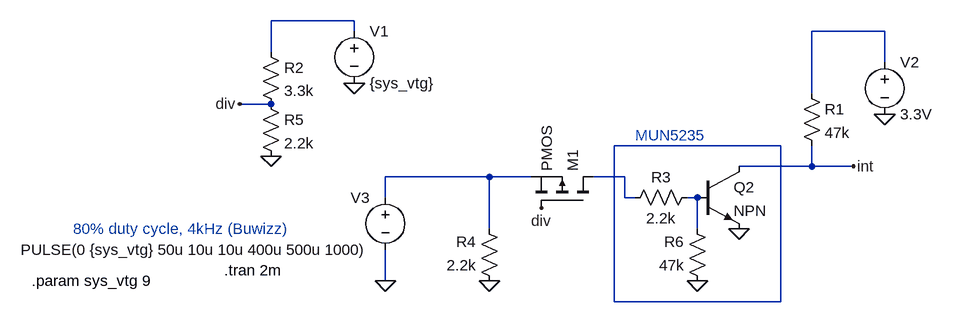
[diagram p0: schematic atomlink_PF_reader_v4.asc]
atomlink_PF_reader_v4.asc, the LTspice schematic file:
Version 4
SHEET 1 880 680
WIRE -960 -528 -1088 -528
WIRE -960 -512 -960 -528
WIRE -144 -512 -256 -512
WIRE -1088 -480 -1088 -528
WIRE -144 -464 -144 -512
WIRE -256 -416 -256 -512
WIRE -1088 -400 -1136 -400
WIRE -304 -336 -560 -336
WIRE -256 -304 -256 -336
WIRE -256 -304 -368 -304
WIRE -192 -304 -256 -304
WIRE -752 -288 -912 -288
WIRE -688 -288 -752 -288
WIRE -544 -288 -592 -288
WIRE -912 -256 -912 -288
WIRE -544 -256 -544 -288
WIRE -528 -256 -544 -256
WIRE -432 -256 -448 -256
WIRE -752 -208 -752 -288
WIRE -432 -208 -432 -256
WIRE -912 -128 -912 -176
WIRE -560 -96 -560 -336
WIRE -304 -96 -304 -336
WIRE -304 -96 -560 -96
FLAG -752 -128 0
FLAG -1088 -320 0
FLAG -192 -304 int
FLAG -144 -384 0
FLAG -672 -240 div
FLAG -960 -432 0
FLAG -1136 -400 div
FLAG -368 -208 0
FLAG -432 -128 0
FLAG -912 -128 0
SYMBOL res -272 -432 R0
SYMATTR InstName R1
SYMATTR Value 47k
SYMBOL res -1104 -496 R0
SYMATTR InstName R2
SYMATTR Value 3.3k
SYMBOL res -736 -112 R180
WINDOW 0 36 76 Left 2
WINDOW 3 36 40 Left 2
SYMATTR InstName R4
SYMATTR Value 2.2k
SYMBOL voltage -960 -528 R0
SYMATTR InstName V1
SYMATTR Value {sys_vtg}
SYMBOL voltage -144 -480 R0
SYMATTR InstName V2
SYMATTR Value 3.3V
SYMBOL voltage -912 -272 M0
WINDOW 123 0 0 Left 0
WINDOW 39 0 0 Left 0
SYMATTR InstName V3
SYMATTR Value PULSE(0 {sys_vtg} 50u 10u 10u 400u 500u 1000)
SYMBOL res -1104 -416 R0
SYMATTR InstName R5
SYMATTR Value 2.2k
SYMBOL npn -432 -304 R0
SYMATTR InstName Q2
SYMBOL res -432 -272 R90
WINDOW 0 0 56 VBottom 2
WINDOW 3 32 56 VTop 2
SYMATTR InstName R3
SYMATTR Value 2.2k
SYMBOL res -416 -112 R180
WINDOW 0 36 76 Left 2
WINDOW 3 36 40 Left 2
SYMATTR InstName R6
SYMATTR Value 47k
SYMBOL pmos -592 -240 M270
SYMATTR InstName M1
TEXT -1160 -144 Left 2 !.tran 2m
TEXT -1392 -208 Left 2 ;80% duty cycle, 4kHz (Buwizz)
TEXT -528 -352 Left 2 ;MUN5235
TEXT -1456 -128 Left 2 !.param sys_vtg 9

The netlist it stands for:
* atomlink_PF_reader_v4.asc
R1 N002 int 47k
R2 N001 div 3.3k
R4 0 N004 2.2k
V1 N001 0 {sys_vtg}
V2 N002 0 3.3V
V3 N004 0 PULSE(0 {sys_vtg} 50u 10u 10u 400u 500u 1000)
R5 div 0 2.2k
Q2 int N006 0 0 NPN
R3 N006 N005 2.2k
R6 0 N006 47k
M1 N005 div N004 N004 PMOS
.model NPN NPN
.model PNP PNP
.lib standard.bjt
.model NMOS NMOS
.model PMOS PMOS
.lib standard.mos
.tran 2m
* 80% duty cycle, 4kHz (Buwizz)
* MUN5235
.param sys_vtg 9
.backanno
.end